# EAGLE design Eye-of-Ord-v1.2 (EAGLE 8.1.1)
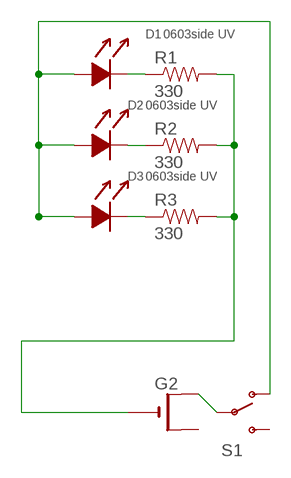
[diagram p0: schematic, sheet 1]

## Parts
D1  0603side UV  0603SIDELED  [SMD-0603-LED-SIDE]
D2  0603side UV  0603SIDELED  [SMD-0603-LED-SIDE]
D3  0603side UV  0603SIDELED  [SMD-0603-LED-SIDE]
G2  CR2032SMT  [CR2032-SMD]
R1  330  RESISTOR0603-RES  [0603-RES]
R2  330  RESISTOR0603-RES  [0603-RES]
R3  330  RESISTOR0603-RES  [0603-RES]
S1  SWITCH-SPDT-SMD-A  [SWITCH-SPST-SMD-A]

## Nets
GND: G2.- R1.2 R2.2 R3.2
N$3: D2.C(K) R2.1
N$4: D3.C(K) R3.1
N$5: D1.C(K) R1.1
N$6: G2.+$1(+) S1.2(P)
VCC: D1.A D2.A D3.A S1.1(O)
Unconnected: G2.+$2(+1) S1.3(S)

## Library data of the parts
D1-D3 = hh-led-2019:0603SIDELED
G2 = adafruit:CR2032; DIGIKEY_PART_ID: BK-913-ND
R1-R3 = SparkFun-Resistors:RESISTOR: Resistor Basic schematic elements and footprints for 0603, 1206, and PTH resistors.; DIGIKEY_PART_ID: P100BZCT-ND
S1 = SparkFun-Electromechanical:SWITCH-SPDT: SPDT Switch Simple slide switch, Spark Fun Electronics SKU : COM-00102 DPDT SMT slide switch, AYZ0202, SWCH-08179; DIGIKEY_PART_ID: 679-1847-1-ND; PROD_ID: SWCH-10651

## Board
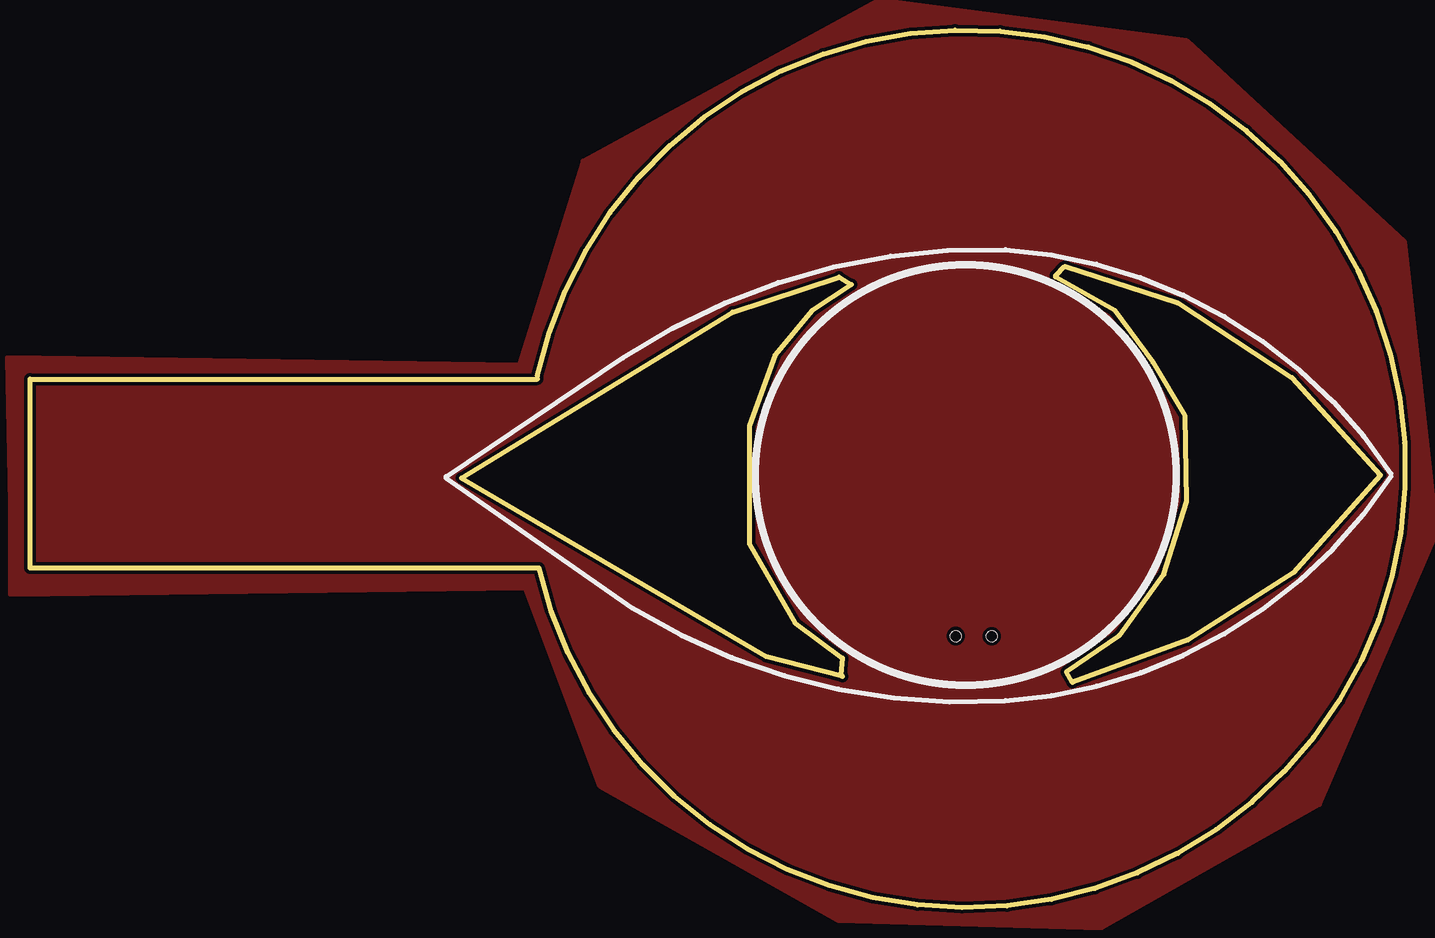
[diagram p1: board, top side]
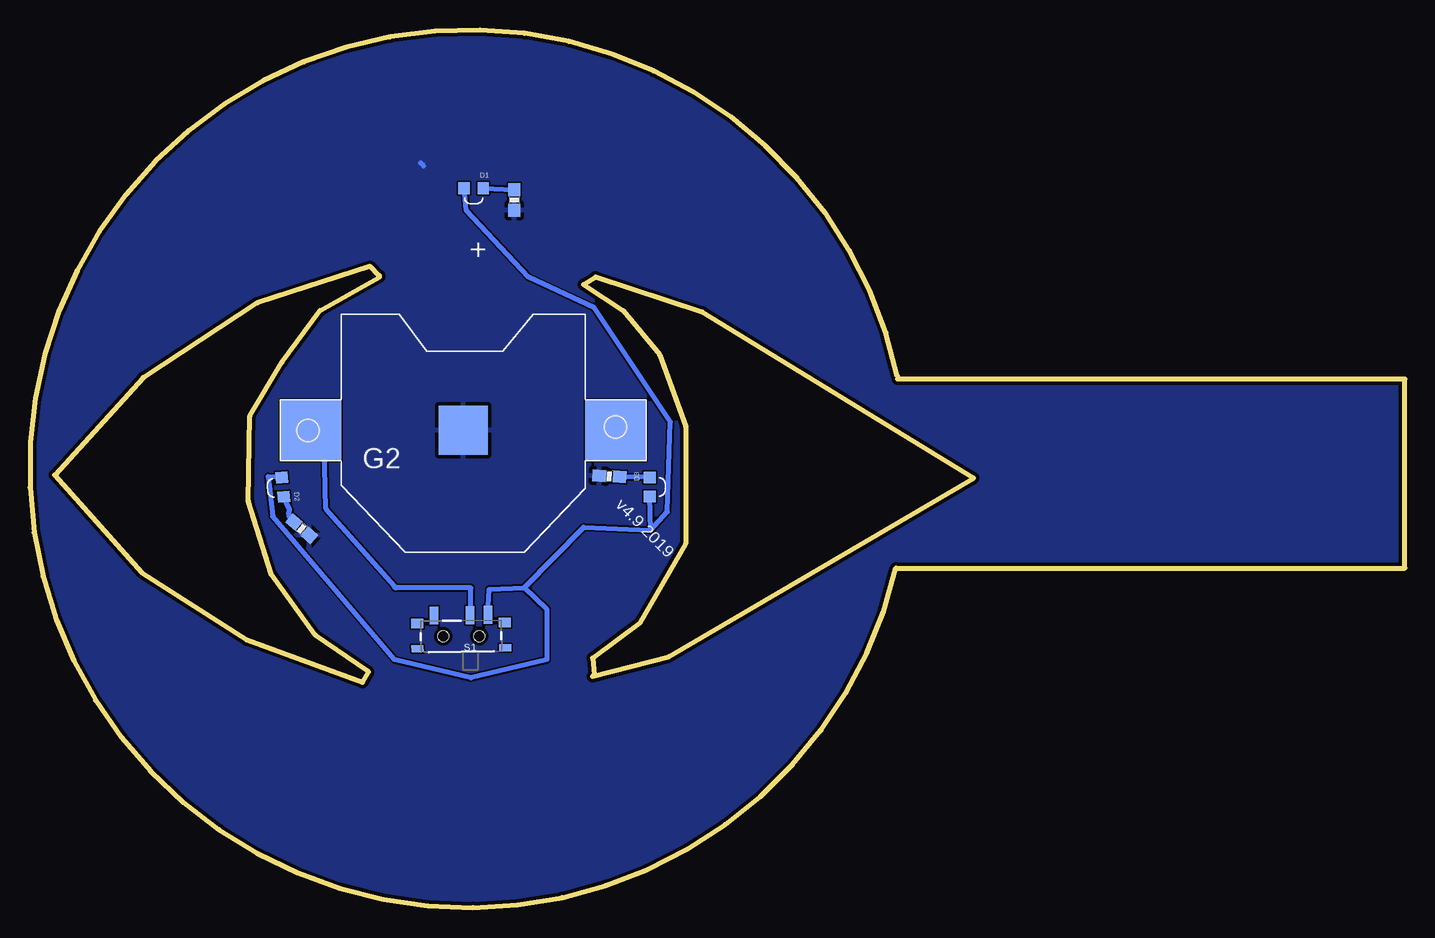
[diagram p2: board, bottom side, seen from below]

Size 114.58 x 73.13 mm. Coordinates in mm from the lower left corner, seen from the top.
Outline: 42.29,44.04 0,44.04 0,28.29 42.42,28.29 arc335 42.29,44.29
Copper layers (1*16): Top 0.035mm / dielectric 0.2mm / Bottom 0.035mm
Design rules "Eagle_WEdirekt_150_check *": minimum track width 6mil, minimum drill 0.25mm, track to track 6mil, track to pad 8mil, pad to pad 8mil, via to via 6mil, smd to smd 8mil, copper to edge 12mil, drill to drill 24mil, minimum pad ring 9mil, minimum via ring 9mil, stop-mask expansion 3mil, vias tented up to drill 0mil, thermal gap 12mil

### Footprints (pad centres in the part's own frame; a part is rotated, then mirrored left to right if it is on the bottom)
SMD-0603-LED-SIDE = smd 0.95 x 1: A 0.8,0; C -0.8,0
CR2032-SMD = smd 5.08 x 5.08: +$1 -12.7,0; +$2 12.7,0 | smd 4.064 x 4.064: - 0,0
0603-RES = smd 1.1 x 1: 1 -0.85,0; 2 0.85,0
SWITCH-SPST-SMD-A = smd 0.7 x 1.5: 1 -2.25,-1.75; 2 -0.75,-1.75; 3 2.25,-1.75 | smd 1 x 0.6: GND1 -3.65,1; GND3 3.65,1 | smd 1 x 0.8: GND2 -3.65,-1.1; GND4 3.65,-1.1 | hole 0.9: -1.5,0; 1.5,0

### Placement (x,y rotation side)
D1  77.61,59.94 180 bottom
D2  93.52,35.04 95 bottom
D3  62.92,35.05 270 bottom
G2  78.48,39.78 0 bottom
R1  74.23,58.96 270 bottom
R2  91.94,31.59 319 bottom
R3  66.29,35.95 177 bottom
S1  78.65,22.62 180.6 bottom

### Tracks (layer width: path | path; a pad name or v marks a point on that pad's centre or on a via)
GND
  Bottom 0.406: 78.61,39.78 G2.- 78.2,39.5 | 81.79,61.82 82.04,62.07 | 74.12,58.01 R1.2
  pour Bottom: 15.24,45.81 41.91,44.67 47.62,64.1 71.75,76.55 94.11,71.98 114.3,54.58 115.57,25.24 105.79,8.86 88.14,-1.05 66.55,-0.41 48.51,11.02 41.27,27.65 -1.52,27.53 -1.02,46.2 5.72,45.94
N$2
  pour Top: -1.65,26.13 41.27,26.64 47.5,10.13 67.31,-1.05 89.28,-1.68 107.44,8.6 117.22,31.34 114.55,55.47 96.39,72.23 70.74,75.66 46.1,62.2 40.77,45.18 -1.91,45.81 -1.65,33.62
N$3
  Bottom 0.406: R2.1 arc90 92.94,33.14 D2.C
N$4
  Bottom 0.406: D3.C R3.1
N$5
  Bottom 0.406: D1.C R1.1
N$6
  Bottom 0.406: S1.2 arc-90 77.85,24.44 77.85,26.64 84.07,26.64 arc90 84.2,26.76 89.92,33.24 90.04,38.45 G2.+$1
VCC
  Bottom 0.406: 73.41,26.64 68.45,31.72 62.87,31.46 | 62.87,31.46 D3.A | S1.1 76.33,26.51 73.41,26.64 | 73.41,26.64 71.5,24.86 71.5,20.67 77.85,19.14 84.2,20.67 94.36,32.61 94.74,35.91 D2.A | 62.87,31.46 61.47,32.99 61.21,40.48 67.56,50.01 73.03,52.55 78.23,58.13 D1.A

### Text on the board
bPlace: + | v4.9 2019